# EAGLE design working (EAGLE 9.0.1)
REV: C
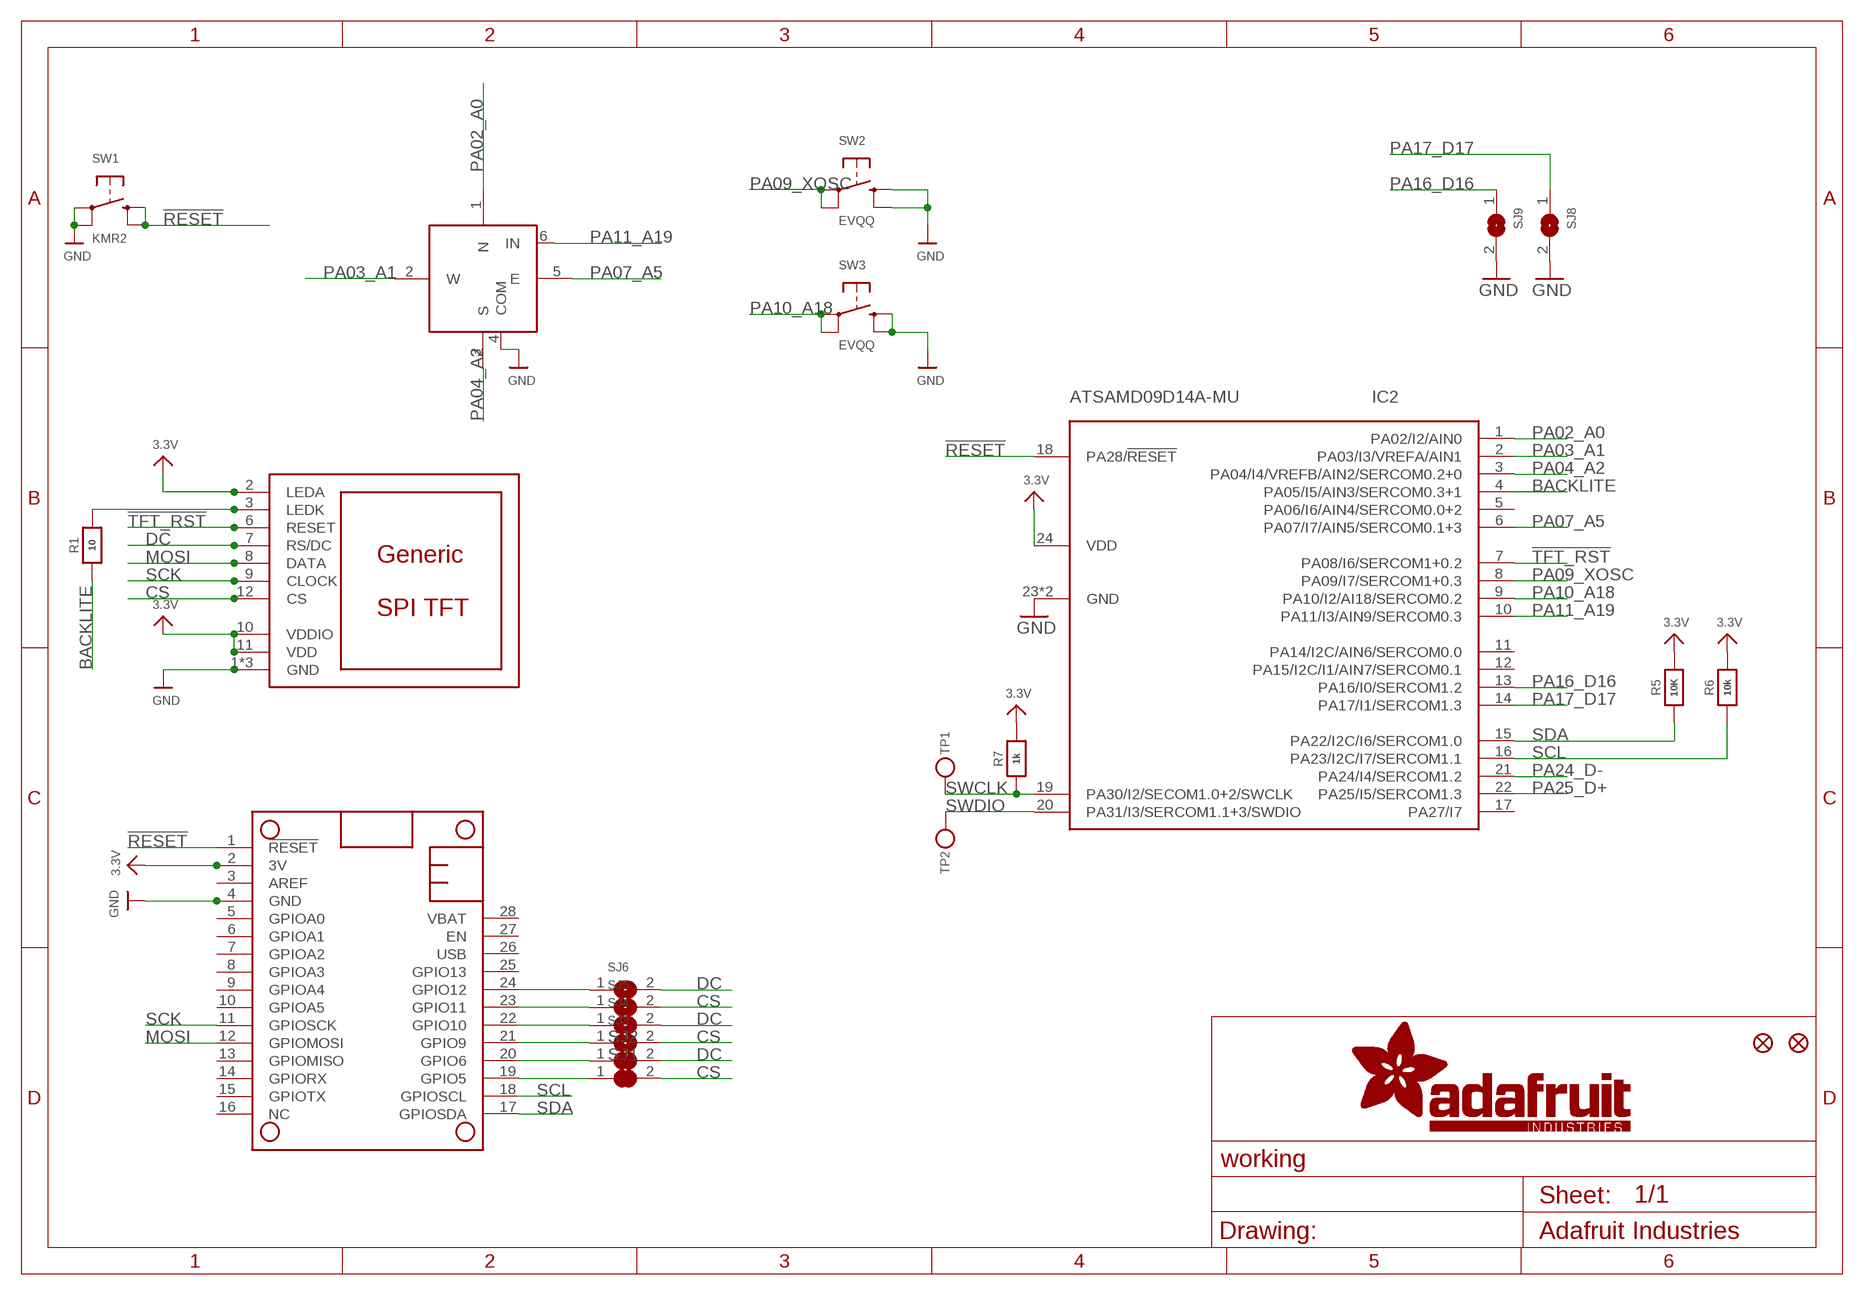
[diagram p0: schematic, sheet 1]

## Parts
FID1  FIDUCIAL_1MM  [FIDUCIAL_1MM]
FID2  FIDUCIAL_1MM  [FIDUCIAL_1MM]
IC2  ATSAMD09D14A-MU  [QFN24_4MM]
MS1  FEATHERWING  [FEATHERWING]
R1  10  RESISTOR_0603_NOOUT  [0603-NO]
R5  10K  RESISTOR_0603_NOOUT  [0603-NO]
R6  10k  RESISTOR_0603_NOOUT  [0603-NO]
R7  1k  RESISTOR_0603_NOOUT  [0603-NO]
SJ1  SOLDERJUMPER_CLOSED  [SOLDERJUMPER_CLOSEDWIRE]
SJ2  SOLDERJUMPER_CLOSED  [SOLDERJUMPER_CLOSEDWIRE]
SJ3  SOLDERJUMPER  [SOLDERJUMPER_ARROW_NOPASTE]
SJ4  SOLDERJUMPER  [SOLDERJUMPER_ARROW_NOPASTE]
SJ5  SOLDERJUMPER  [SOLDERJUMPER_ARROW_NOPASTE]
SJ6  SOLDERJUMPER  [SOLDERJUMPER_ARROW_NOPASTE]
SJ8  SOLDERJUMPER  [SOLDERJUMPER_ARROW_NOPASTE]
SJ9  SOLDERJUMPER  [SOLDERJUMPER_ARROW_NOPASTE]
SW1  KMR2  SWITCH_TACT_SMT4.6X2.8  [BTN_KMR2_4.6X2.8]
SW2  EVQQ  SWITCH_TACT_SMT_EVQQ2_SMALL  [EVQ-Q2_SMALLER]
SW3  EVQQ  SWITCH_TACT_SMT_EVQQ2_SMALL  [EVQ-Q2_SMALLER]
SW4  NAVSWITCHSKQUABAUE010  [SKQUBAE010]
TP1  TESTPOINTROUND2MM  [TESTPOINT_ROUND_2MM]
TP2  TESTPOINTROUND2MM  [TESTPOINT_ROUND_2MM]
U$2  DISP_LCD_0.9IN_160X80  [TFT_0.96IN_160X80]

## Nets
3.3V: IC2.24(VDD) MS1.2(3V) R5.2 R6.2 R7.2 U$2.2(LEDA) U$2.10(VDDIO) U$2.11(VDD)
!RESET: IC2.18(PA28/!RESET) MS1.1(!RESET) SW1.B'(S1) SW1.B(S)
!TFT_RST: IC2.7(PA08/I6/SERCOM1+0.2) U$2.6(RESET)
BACKLITE: IC2.4(PA05/I5/AIN3/SERCOM0.3+1) R1.1
CS: SJ1.2 SJ3.2 SJ5.2 U$2.12(CS)
DC: SJ2.2 SJ4.2 SJ6.2 U$2.7(RS/DC)
GND: IC2.23(GND) IC2.THERM(GND) MS1.4(GND) SJ8.2 SJ9.2 SW1.A'(P1) SW1.A(P) SW2.B'(S1) SW2.B(S) SW3.B'(S1) SW3.B(S) SW4.4(COM) U$2.1(GND) U$2.5(GND) U$2.13(GND)
MOSI: MS1.12(GPIOMOSI) U$2.8(DATA)
N$3: MS1.20(GPIO6) SJ2.1
N$4: MS1.19(GPIO5) SJ1.1
N$5: MS1.21(GPIO9) SJ3.1
N$6: MS1.22(GPIO10) SJ4.1
N$7: MS1.23(GPIO11) SJ5.1
N$8: MS1.24(GPIO12) SJ6.1
N$9: R1.2 U$2.3(LEDK)
PA02_A0: IC2.1(PA02/I2/AIN0) SW4.1(N)
PA03_A1: IC2.2(PA03/I3/VREFA/AIN1) SW4.2(W)
PA04_A2: IC2.3(PA04/I4/VREFB/AIN2/SERCOM0.2+0) SW4.3(S)
PA07_A5: IC2.6(PA07/I7/AIN5/SERCOM0.1+3) SW4.5(E)
PA09_XOSC: IC2.8(PA09/I7/SERCOM1+0.3) SW2.A'(P1) SW2.A(P)
PA10_A18: IC2.9(PA10/I2/AI18/SERCOM0.2) SW3.A'(P1) SW3.A(P)
PA11_A19: IC2.10(PA11/I3/AIN9/SERCOM0.3) SW4.6(IN)
PA16_D16: IC2.13(PA16/I0/SERCOM1.2) SJ9.1
PA17_D17: IC2.14(PA17/I1/SERCOM1.3) SJ8.1
PA24_D-: IC2.21(PA24/I4/SERCOM1.2)
PA25_D+: IC2.22(PA25/I5/SERCOM1.3)
SCK: MS1.11(GPIOSCK) U$2.9(CLOCK)
SCL: IC2.16(PA23/I2C/I7/SERCOM1.1) MS1.18(GPIOSCL) R6.1
SDA: IC2.15(PA22/I2C/I6/SERCOM1.0) MS1.17(GPIOSDA) R5.1
SWCLK: IC2.19(PA30/I2/SECOM1.0+2/SWCLK) R7.1 TP1.P$1
SWDIO: IC2.20(PA31/I3/SERCOM1.1+3/SWDIO) TP2.P$1
Unconnected: IC2.5(PA06/I6/AIN4/SERCOM0.0+2) IC2.11(PA14/I2C/AIN6/SERCOM0.0) IC2.12(PA15/I2C/I1/AIN7/SERCOM0.1) IC2.17(PA27/I7) MS1.3(AREF) MS1.5(GPIOA0) MS1.6(GPIOA1) MS1.7(GPIOA2) MS1.8(GPIOA3) MS1.9(GPIOA4) MS1.10(GPIOA5) MS1.13(GPIOMISO) MS1.14(GPIORX) MS1.15(GPIOTX) MS1.16(NC) MS1.25(GPIO13) MS1.26(USB) MS1.27(EN) MS1.28(VBAT)

## Library data of the parts
FID1 FID2 = microbuilder:FIDUCIAL: Fiducial Alignment Points Various fiducial points for machine vision alignment.; BOM: EXCLUDE
IC2 = microbuilder:ATSAMD09D14A
MS1 = microbuilder:FEATHERWING
R1 R5-R7 = microbuilder:RESISTOR: Resistors For new designs, use the packages preceded by an '_' character since they are more reliable: The following footprints should be used on most boards: _0402 - Standard footprint for regular board layouts _0603 - Standard footprint for regular board layouts _0805 - Standard footprint for regular board layouts _1206 - Standard footprint for regular board layouts For extremely tight-pitch boards where space is at a premium, the following 'micro-pitch' footprints can be used (smaller pads, no silkscreen outline, etc.): _0402MP - Micro-pitch footprint for very dense/compact boards _0603MP - Micro-pitch footprint for very dense/compact boards _0805MP - Micro-pitch footprint for very dense/compact boards _1206MP - Micro-pitch footprint for very dense/compact boards
SJ1 SJ2 = microbuilder:SOLDERJUMPER_CLOSED: Solder Jumper - Closed These solder jumpers are closed by default CLOSEDWIRE - 10 mil trace between pads that can be cut and resoldered later CLOSEDPERM - 63 mil trace between pads for a permanent connection (used to 'bridge' two signals, a shameless hack for Eagle). Can double as a test point as well (no cream layer)
SJ3-SJ6 SJ8 SJ9 = microbuilder:SOLDERJUMPER: SMD Solder JUMPER Solder the two pads together to create a connection, or remove the solder to break it. REFLOW - Use this footprint for solder paste and reflow ovens. WAVE - Use this footprint for hand-soldering (larger pads). CLOSED - Has a trace between the two pads to ensure it is closed by default. The trace needs to be cut to disable the jumper, and can be closed again by creating a solder bridge between the two pads.; BOM: EXCLUDE
SW1-SW3 = microbuilder:SWITCH_TACT_SMT: SMT Tact Switches 6x6mm - Digikey: P12940SCT-ND KMR2 (4.6x2.8mm) - Digikey: 401-1426-1-ND EVQ-PQHB55 - Light Touch, 160GF (4.5x4.5mm) - Digikey: P8090SCT-ND KMT0 - KMT021 NGJ LHS (etc.) IP68/Waterproof - Digikey: CKN10289CT-ND
SW4 = microbuilder:NAVSWITCH
TP1 TP2 = microbuilder:TESTPOINT: Test Point Various test points for characterisation and PCB testing TESTPOINT_SMT - Compact Surface Mount Test Point [Digikey: 5016KTR-ND]
U$2 = microbuilder:DISP_LCD_0.9IN_160X80

## Board
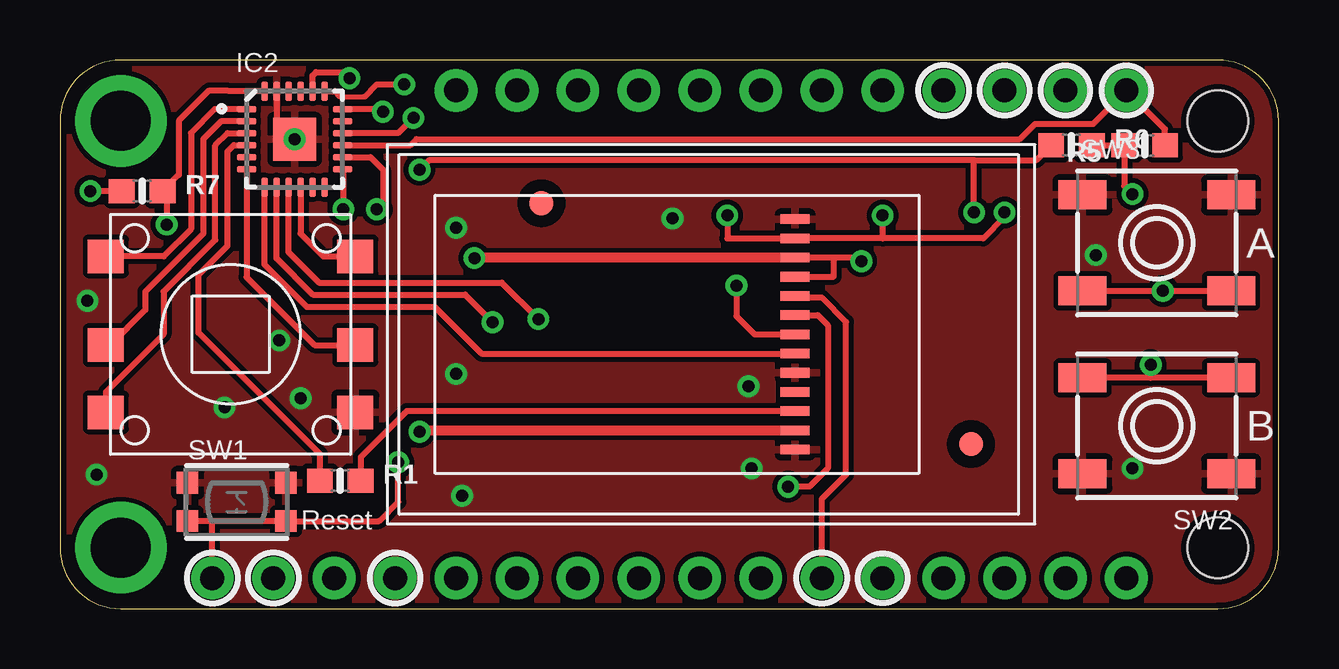
[diagram p1: board, top side]
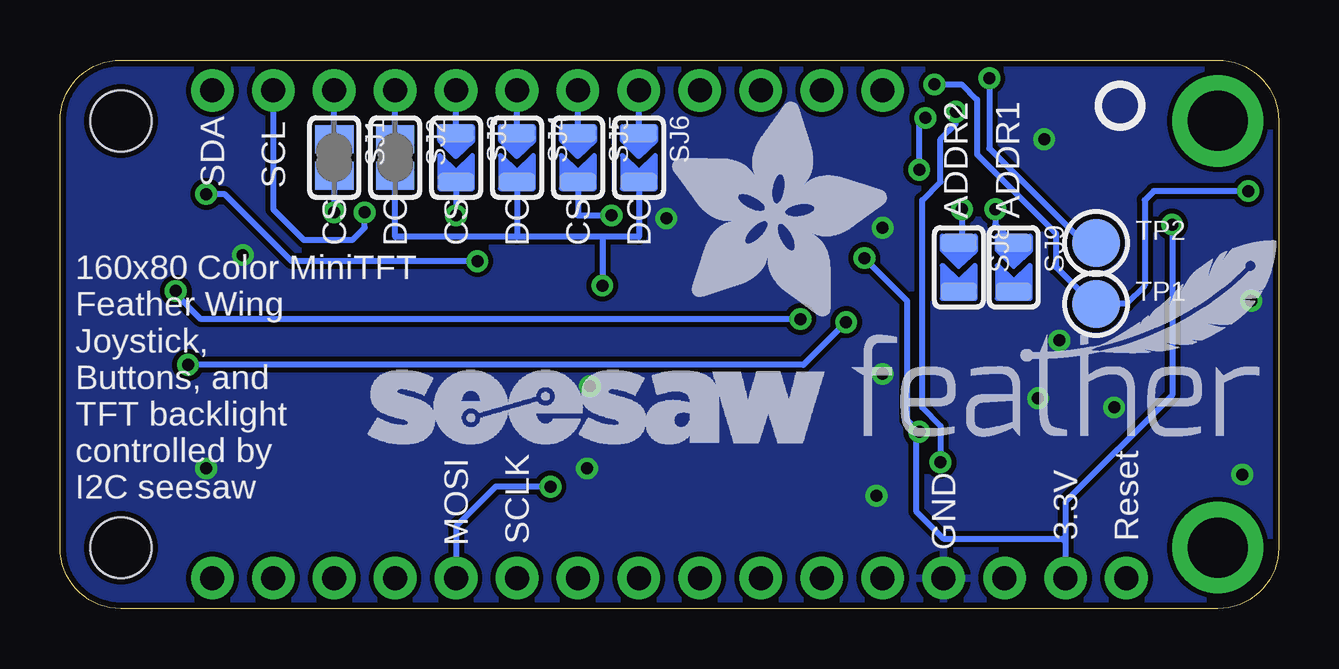
[diagram p2: board, bottom side, seen from below]

Size 50.8 x 22.86 mm. Coordinates in mm from the lower left corner, seen from the top.
Outline: 50.8,15.24 50.8,20.32 arc90 48.26,22.86 2.54,22.86 arc90 0,20.32 0,2.54 arc90 2.54,0 48.26,0 arc90 50.8,2.54 50.8,5.08
Copper layers (1*16): Top 0.035mm / dielectric 1.5mm / Bottom 0.035mm
Design rules "adafruit *": minimum track width 8mil, minimum drill 15.5mil, track to track 8mil, track to pad 8mil, pad to pad 8mil, via to via 8mil, smd to smd 8mil, copper to edge 10mil, drill to drill 8mil, minimum pad ring 10mil, minimum via ring 8mil, stop-mask expansion 2mil, vias tented up to drill 20mil, thermal gap 10mil

### Footprints (pad centres in the part's own frame; a part is rotated, then mirrored left to right if it is on the bottom)
FIDUCIAL_1MM = smd 1 x 1: 1 0,0
QFN24_4MM = smd 0.8 x 0.28: 1 -2,1.25; 2 -2,0.75; 3 -2,0.25; 4 -2,-0.25; 5 -2,-0.75; 6 -2,-1.25; 13 2,-1.25; 14 2,-0.75; 15 2,-0.25; 16 2,0.25; 17 2,0.75; 18 2,1.25 | smd 0.28 x 0.8: 7 -1.25,-2; 8 -0.75,-2; 9 -0.25,-2; 10 0.25,-2; 11 0.75,-2; 12 1.25,-2; 19 1.25,2; 20 0.75,2; 21 0.25,2; 22 -0.25,2; 23 -0.75,2; 24 -1.25,2 | smd 1.778 x 1.778: THERM 0,0
FEATHERWING = drill 1 pad 1.778: 1 6.35,1.27; 2 8.89,1.27; 3 11.43,1.27; 4 13.97,1.27; 5 16.51,1.27; 6 19.05,1.27; 7 21.59,1.27; 8 24.13,1.27; 9 26.67,1.27; 10 29.21,1.27; 11 31.75,1.27; 12 34.29,1.27; 13 36.83,1.27; 14 39.37,1.27; 15 41.91,1.27; 16 44.45,1.27; 17 44.45,21.59; 18 41.91,21.59; 19 39.37,21.59; 20 36.83,21.59; 21 34.29,21.59; 22 31.75,21.59; 23 29.21,21.59; 24 26.67,21.59; 25 24.13,21.59; 26 21.59,21.59; 27 19.05,21.59; 28 16.51,21.59 | drill 2.5 pad 3.81: P$1 2.54,20.32; P$2 2.54,2.54 | hole 2.54: 48.26,20.32; 48.26,2.54
0603-NO = smd 1.075 x 1: 1 -0.85,0; 2 0.85,0
SOLDERJUMPER_CLOSEDWIRE = smd 1.168 x 1.6: 1 -0.762,0; 2 0.762,0 | smd 0.635 x 0.203: WIRE 0,0
SOLDERJUMPER_ARROW_NOPASTE = smd 0.762 x 1.524: 1 -1.016,0; 2 1.016,0
BTN_KMR2_4.6X2.8 = smd 0.9 x 0.9: A 2.05,0.8; A' -2.05,0.8; B 2.05,-0.8; B' -2.05,-0.8
EVQ-Q2_SMALLER = smd 2 x 1.2: A -3.1,-2; A' 3.1,-2; B -3.1,2; B' 3.1,2
SKQUBAE010 = smd 1.5 x 1.4: 1 -5.2,3.25; 2 -5.2,-0.45; 3 -5.2,-3.25; 4 5.2,-3.25; 5 5.2,-0.45; 6 5.2,3.25
TESTPOINT_ROUND_2MM = smd 2 x 2: P$1 0,0
TFT_0.96IN_160X80 = smd 0.4 x 1.2: 1 -4.8,10; 2 -4,10; 3 -3.2,10; 4 -2.4,10; 5 -1.6,10; 6 -0.8,10; 7 0,10; 8 0.8,10; 9 1.6,10; 10 2.4,10; 11 3.2,10; 12 4,10; 13 4.8,10

### Placement (x,y rotation side)
FID1  20.07,16.89 0 top
FID2  37.97,6.86 0 top
IC2  9.78,19.56 0 top
MS1  0,0 0 top
R1  11.68,5.33 0 top
R5  45.21,19.3 180 top
R6  42.16,19.3 0 top
R7  3.43,17.4 0 top
SJ1  39.37,18.8 270 bottom
SJ2  36.83,18.8 270 bottom
SJ3  34.29,18.8 270 bottom
SJ4  31.75,18.8 270 bottom
SJ5  29.21,18.8 270 bottom
SJ6  26.67,18.8 270 bottom
SJ8  13.34,14.22 270 bottom
SJ9  11.05,14.22 270 bottom
SW1  7.37,4.45 0 top
SW2  45.72,7.62 180 top
SW3  45.72,15.24 0 top
SW4  7.11,11.43 0 top
TP1  7.62,12.7 0 bottom
TP2  7.62,15.24 0 bottom
U$2  40.64,11.43 90 top
U$4  [FEATHERLOGO_MED]  17.91,7.11 0 bottom
U$8  [SEESAW_LOGO]  37.97,6.86 0 bottom
U$12  [ADAFRUIT_9MM]  25.27,12.19 0 bottom
U$14  [PCBFEAT-REV-040]  6.6,20.95 0 bottom

### Tracks (layer width: path | path; a pad name or v marks a point on that pad's centre or on a via)
3.3V  (via drill 0.5)
  Top 0.254: 32.26,14.63 U$2.11 | U$2.10 32.26,13.83 32.26,14.63 | IC2.24 7.02,21.56 6.99,21.59 6.22,21.59 4.95,20.32 4.95,18.07 R7.2 4.36,17.4 4.45,17.49 v4.45,16 | v33.4,14.48 33.4,14.63 32.26,14.63 | R6.2 R5.2 44.36,17.61 v44.7,17.27
  Top 0.406: v14.99,7.37 15.05,7.43 U$2.2 | U$2.11 17.25,14.63 v17.27,14.61
  Bottom 0.254: v17.27,14.61 15.49,12.83 15.49,7.87 v14.99,7.37 15.11,7.24 15.11,4.06 13.97,2.92 9.02,2.92 8.89,2.79 | v33.4,14.48 41.15,14.48 43.94,17.27 v44.7,17.27 | v4.45,16 4.45,8.89 8.89,4.45 8.89,2.79 | 8.89,2.79 MS1.2
  Bottom 0.406: v17.27,14.61 17.27,14.86
!RESET  (via drill 0.5)
  Top 0.254: 6.35,3.65 SW1.B 13.3,3.65 14.1,4.45 v14.1,6.1 | 6.35,3.65 SW1.B' | v13.46,20.7 13.36,20.81 IC2.18 | MS1.1 6.35,3.65
  Bottom 0.254: v13.46,20.7 13.46,20.19 14.1,19.56 14.1,17.78 14.86,17.02 14.86,8.38 14.1,7.62 v14.1,6.1
!TFT_RST
  Top 0.254: U$2.6 17.56,10.63 15.62,12.57 10.29,12.57 8.53,14.33 IC2.7
BACKLITE
  Top 0.254: IC2.4 7.24,19.31 6.99,19.05 6.99,15.11 5.78,13.91 5.78,11.49 10.83,6.44 R1.1
CS  (via drill 0.5)
  Top 0.254: 34.29,15.43 U$2.12 27.81,15.43 v27.81,16.38 | 34.29,15.43 38.48,15.43 39.37,16.32 v39.37,16.51 | v34.29,16.38 34.29,15.43
  Bottom 0.254: SJ5.2 29.21,16.38 v27.81,16.38 | SJ1.2 v39.37,16.51 | SJ3.2 v34.29,16.38
DC  (via drill 0.5)
  Top 0.254: v28.19,13.46 28.19,12.19 28.96,11.43 U$2.7
  Bottom 0.254: 28.19,15.49 v28.19,13.46 | SJ6.2 26.67,15.49 28.19,15.49 | 28.19,15.49 31.75,15.49 | 31.75,15.49 36.83,15.49 SJ2.2 | SJ4.2 31.75,15.49
GND  (via drill 0.5)
  Top 0.254: IC2.23 9.03,19.56 IC2.THERM
  other vias: 1.52,5.59 10.03,8.76 28.83,5.84 44.7,5.84 25.53,16.26 28.7,9.27 43.18,14.73 9.78,19.56 9.14,11.18 1.14,12.83 6.86,8.38 16.51,9.78 16.51,15.88 16.76,4.7
  pour Bottom: 0,22.86 0,0 50.8,0 50.8,22.86
  pour Top: 0,22.86 0,0 50.8,0 50.8,22.86
MOSI  (via drill 0.5)
  Top 0.254: U$2.8 31.59,12.23 32,11.81 32,5.84 31.24,5.08 v30.35,5.08
  Bottom 0.254: v30.35,5.08 32.64,5.08 34.29,3.43 MS1.12
N$3
  Bottom 0.254: SJ2.1 MS1.20
N$4
  Bottom 0.254: SJ1.1 MS1.19
N$5
  Bottom 0.254: SJ3.1 MS1.21
N$6
  Bottom 0.254: SJ4.1 MS1.22
N$7
  Bottom 0.254: SJ5.1 MS1.23
N$8
  Bottom 0.254: SJ6.1 MS1.24
N$9
  Top 0.254: U$2.3 14.45,8.23 12.53,6.31 R1.2
PA02_A0
  Top 0.254: SW4.1 4.33,14.68 5.46,15.82 5.46,19.81 6.46,20.81 IC2.1
PA03_A1
  Top 0.254: IC2.2 6.72,20.31 5.97,19.56 5.97,15.62 3.56,13.21 3.56,12.45 2.09,10.98 SW4.2
PA04_A2
  Top 0.254: SW4.3 1.91,9.02 4.32,11.43 4.32,13.21 6.48,15.37 6.48,19.3 6.98,19.81 IC2.3
PA07_A5
  Top 0.254: IC2.6 7.78,13.81 10.61,10.98 SW4.5
PA09_XOSC  (via drill 0.5)
  Top 0.254: v18.03,11.94 16.89,13.08 10.54,13.08 9.03,14.59 IC2.8 | SW2.A 45.47,9.62 | 45.47,9.62 SW2.A' | 45.47,9.62 v45.47,10.16
  Bottom 0.254: v18.03,11.94 19.81,10.16 v45.47,10.16
PA10_A18  (via drill 0.5)
  Top 0.254: SW3.A v45.97,13.24 SW3.A' | v19.94,12.06 18.41,13.59 10.79,13.59 9.53,14.86 IC2.9
  Bottom 0.254: v19.94,12.06 44.93,12.06 45.97,13.11 v45.97,13.24
PA11_A19
  Top 0.254: IC2.10 10.03,15.62 10.97,14.68 SW4.6
PA16_D16  (via drill 0.5)
  Top 0.254: IC2.13 11.81,18.28 v11.81,16.64
  Bottom 0.254: v11.81,16.64 11.81,16 SJ9.1
PA17_D17  (via drill 0.5)
  Top 0.254: IC2.14 12.94,18.81 13.46,18.29 13.46,16.89 v13.21,16.64
  Bottom 0.254: v13.21,16.64 13.21,15.37 SJ8.1
SCK
  Top 0.254: MS1.11 31.75,4.57 32.77,5.59 32.77,11.94 31.75,12.95 30.72,12.95 U$2.9
SCL  (via drill 0.5)
  Top 0.254: 38.1,18.69 40.7,18.69 R6.1 | v38.1,16.51 38.1,18.69 | IC2.16 14.09,19.81 v14.73,20.45 | 38.1,18.69 15.39,18.69 v14.99,18.29
  Bottom 0.254: MS1.18 41.91,16.64 40.64,15.37 38.61,15.37 38.1,15.88 v38.1,16.51 | v14.99,18.29 14.99,20.19 v14.73,20.45
SDA
  Top 0.254: R5.1 46.06,19.98 MS1.17 43.05,20.19 40.64,20.19 40.01,19.56 14.86,19.56 14.61,19.31 IC2.15
SWCLK  (via drill 0.5)
  Top 0.203: 11.68,21.34 12.7,21.34
  Top 0.254: IC2.19 11.46,21.56 11.68,21.34 | 12.7,21.34 13.21,21.84 v14.35,21.84 | R7.1 v1.27,17.4
  Bottom 0.254: v14.35,21.84 13.21,21.84 12.57,21.21 12.57,18.92 9.27,15.62 9.27,14.22 7.75,12.7 TP1.P$1 6.35,12.7 5.59,13.46 5.59,17.02 5.21,17.4 v1.27,17.4
SWDIO  (via drill 0.5)
  Top 0.254: IC2.20 10.53,22.21 10.67,22.35 11.81,22.35 v12.06,22.1
  Bottom 0.254: v12.06,22.1 12.06,19.18 8.13,15.24 TP2.P$1

### Text on the board
tPlace: A | B | Reset
bPlace: SCL | SDA | ADDR1 | ADDR2 | DC | CS | DC | CS | DC | CS | Reset | SCLK | 160x80 Color MiniTFT / Feather Wing / Joystick, / Buttons, and / TFT backlight / controlled by / I2C seesaw | 3.3V | GND | MOSI